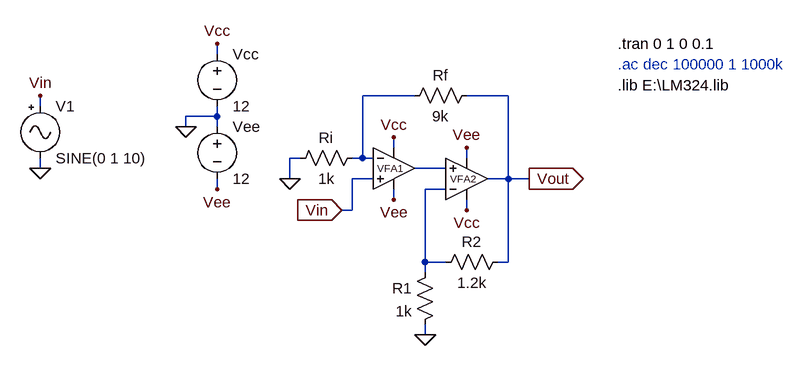
[diagram p0: schematic VFA-VFA.asc]
VFA-VFA.asc, the LTspice schematic file:
Version 4.1
SHEET 1 1072 680
WIRE 96 -64 96 -80
WIRE 400 0 320 0
WIRE 544 0 480 0
WIRE -176 16 -176 0
WIRE 96 32 96 16
WIRE 96 32 48 32
WIRE 48 48 48 32
WIRE 96 48 96 32
WIRE 368 80 368 64
WIRE 224 96 208 96
WIRE 320 96 320 0
WIRE 320 96 304 96
WIRE 336 96 320 96
WIRE 480 96 480 80
WIRE -176 112 -176 96
WIRE 448 112 400 112
WIRE 208 128 208 96
WIRE 336 128 304 128
WIRE 544 128 544 0
WIRE 544 128 512 128
WIRE 576 128 544 128
WIRE 96 144 96 128
WIRE 448 144 416 144
WIRE 368 160 368 144
WIRE 304 176 304 128
WIRE 304 176 288 176
WIRE 480 176 480 160
WIRE 416 256 416 144
WIRE 448 256 416 256
WIRE 544 256 544 128
WIRE 544 256 528 256
WIRE 416 272 416 256
WIRE 416 368 416 352
FLAG 48 48 0
FLAG 96 -80 Vcc
FLAG 96 144 Vee
FLAG 208 128 0
FLAG 576 128 Vout
IOPIN 576 128 Out
FLAG -176 0 Vin
FLAG 480 176 Vcc
FLAG 480 80 Vee
FLAG 368 64 Vcc
FLAG 368 160 Vee
FLAG 416 368 0
FLAG -176 112 0
FLAG 288 176 Vin
IOPIN 288 176 In
SYMBOL res 320 80 R90
WINDOW 0 0 56 VBottom 2
WINDOW 3 32 56 VTop 2
SYMATTR InstName Ri
SYMATTR Value 1k
SYMBOL res 496 -16 R90
WINDOW 0 0 56 VBottom 2
WINDOW 3 32 56 VTop 2
SYMATTR InstName Rf
SYMATTR Value 9k
SYMBOL voltage 96 -80 R0
WINDOW 123 0 0 Left 0
WINDOW 39 0 0 Left 0
SYMATTR InstName Vcc
SYMATTR Value 12
SYMBOL voltage 96 32 R0
WINDOW 123 0 0 Left 0
WINDOW 39 0 0 Left 0
SYMATTR InstName Vee
SYMATTR Value 12
SYMBOL res 432 256 M0
SYMATTR InstName R1
SYMATTR Value 1k
SYMBOL res 544 240 R90
WINDOW 0 0 56 VBottom 2
WINDOW 3 32 56 VTop 2
SYMATTR InstName R2
SYMATTR Value 1.2k
SYMBOL Misc\\signal -176 0 R0
WINDOW 39 0 0 Left 0
SYMATTR InstName V1
SYMATTR Value SINE(0 1 10)
SYMATTR Value2 AC 1
SYMBOL OpAmps\\opamp2 368 48 R0
WINDOW 0 -26 64 Left 1
WINDOW 3 16 96 Invisible 2
SYMATTR InstName VFA1
SYMATTR Value LM324
SYMBOL OpAmps\\opamp2 480 192 M180
WINDOW 0 -25 64 Left 1
WINDOW 3 16 96 Invisible 2
SYMATTR InstName VFA2
SYMATTR Value LM324
TEXT 712 -80 Left 2 !.tran 0 1 0 0.1
TEXT 712 -48 Left 2 ;.ac dec 100000 1 1000k
TEXT 712 -16 Left 2 !.lib E:\\LM324.lib

The netlist it stands for:
* VFA-VFA.asc
Ri N001 0 1k
Rf Vout N001 9k
Vcc Vcc 0 12
Vee 0 Vee 12
R1 N003 0 1k
R2 Vout N003 1.2k
V1 Vin 0 SINE(0 1 10) AC 1
X§VFA1 Vin N001 Vcc Vee N002 LM324  ; pins In+ In- V+ V- OUT
X§VFA2 N002 N003 Vcc Vee Vout LM324  ; pins In+ In- V+ V- OUT
.tran 0 1 0 0.1
* .ac dec 100000 1 1000k
.lib E:\LM324.lib
.backanno
.end